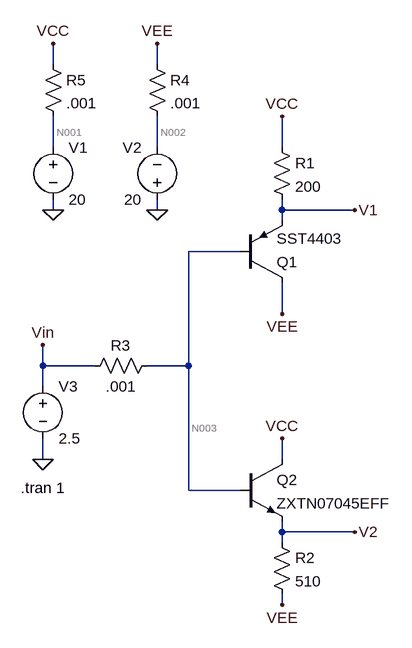
[diagram p0: schematic IDK.asc]
IDK.asc, the LTspice schematic file:
Version 4
SHEET 1 880 876
WIRE -32 -64 -32 -96
WIRE 128 -64 128 -96
WIRE -32 64 -32 16
WIRE 128 64 128 16
WIRE 320 64 320 16
WIRE -32 160 -32 144
WIRE 128 160 128 144
WIRE 320 160 320 144
WIRE 432 160 320 160
WIRE 320 176 320 160
WIRE 256 224 176 224
WIRE 320 320 320 272
WIRE -48 400 -48 368
WIRE 32 400 -48 400
WIRE 176 400 176 224
WIRE 176 400 112 400
WIRE -48 432 -48 400
WIRE -48 544 -48 512
WIRE 320 544 320 512
WIRE 176 592 176 400
WIRE 256 592 176 592
WIRE 320 656 320 640
WIRE 432 656 320 656
WIRE 320 672 320 656
WIRE 320 768 320 752
FLAG -32 160 0
FLAG 128 160 0
FLAG -32 -96 VCC
FLAG 128 -96 VEE
FLAG 320 16 VCC
FLAG 320 320 VEE
FLAG 320 768 VEE
FLAG 320 512 VCC
FLAG 432 160 V1
FLAG 432 656 V2
FLAG -48 544 0
FLAG -48 368 Vin
SYMBOL voltage -32 48 R0
WINDOW 123 0 0 Left 0
WINDOW 39 0 0 Left 0
SYMATTR InstName V1
SYMATTR Value 20
SYMBOL voltage 128 160 R180
WINDOW 0 24 96 Left 2
WINDOW 3 24 16 Left 2
WINDOW 123 0 0 Left 0
WINDOW 39 0 0 Left 0
SYMATTR InstName V2
SYMATTR Value 20
SYMBOL pnp 256 272 M180
SYMATTR InstName Q1
SYMATTR Value SST4403
SYMBOL res 304 48 R0
SYMATTR InstName R1
SYMATTR Value 200
SYMBOL npn 256 544 R0
SYMATTR InstName Q2
SYMATTR Value ZXTN07045EFF
SYMBOL res 304 656 R0
SYMATTR InstName R2
SYMATTR Value 510
SYMBOL voltage -48 416 R0
WINDOW 123 0 0 Left 0
WINDOW 39 0 0 Left 0
SYMATTR InstName V3
SYMATTR Value 2.5
SYMBOL res 128 384 R90
WINDOW 0 0 56 VBottom 2
WINDOW 3 32 56 VTop 2
SYMATTR InstName R3
SYMATTR Value .001
SYMBOL res 112 -80 R0
SYMATTR InstName R4
SYMATTR Value .001
SYMBOL res -48 -80 R0
SYMATTR InstName R5
SYMATTR Value .001
TEXT -82 588 Left 2 !.tran 1

The netlist it stands for:
* IDK.asc
V1 N001 0 20
V2 0 N002 20
Q1 VEE N003 V1 0 SST4403
R1 VCC V1 200
Q2 VCC N003 V2 0 ZXTN07045EFF
R2 V2 VEE 510
V3 Vin 0 2.5
R3 N003 Vin .001
R4 VEE N002 .001
R5 VCC N001 .001
.model NPN NPN
.model PNP PNP
.lib standard.bjt
.tran 1
.backanno
.end

* Results of the author's LTspice run, read from the files saved beside the schematic
* Operating Point, zero values left out:
*   V(n001) = 20 V
*   V(n002) = -20 V
*   V(vee) = -20 V
*   V(n003) = 2.5 V
*   V(v1) = 3.204 V
*   V(vcc) = 20 V
*   V(v2) = 1.882 V
*   V(vin) = 2.5 V
*   Ic(Q2) = 42.86 mA
*   Ib(Q2) = 44.52 µA
*   Ie(Q2) = -42.91 mA
*   Ic(Q1) = -83.66 mA
*   Ib(Q1) = -316 µA
*   Ie(Q1) = 83.98 mA
*   I(R5) = -126.8 mA
*   I(R4) = 126.6 mA
*   I(R3) = 271.5 µA
*   I(R2) = 42.91 mA
*   I(R1) = 83.98 mA
*   I(V3) = 271.5 µA
*   I(V2) = -126.6 mA
*   I(V1) = -126.8 mA